# EAGLE design AV_Board (EAGLE 9.6.2)
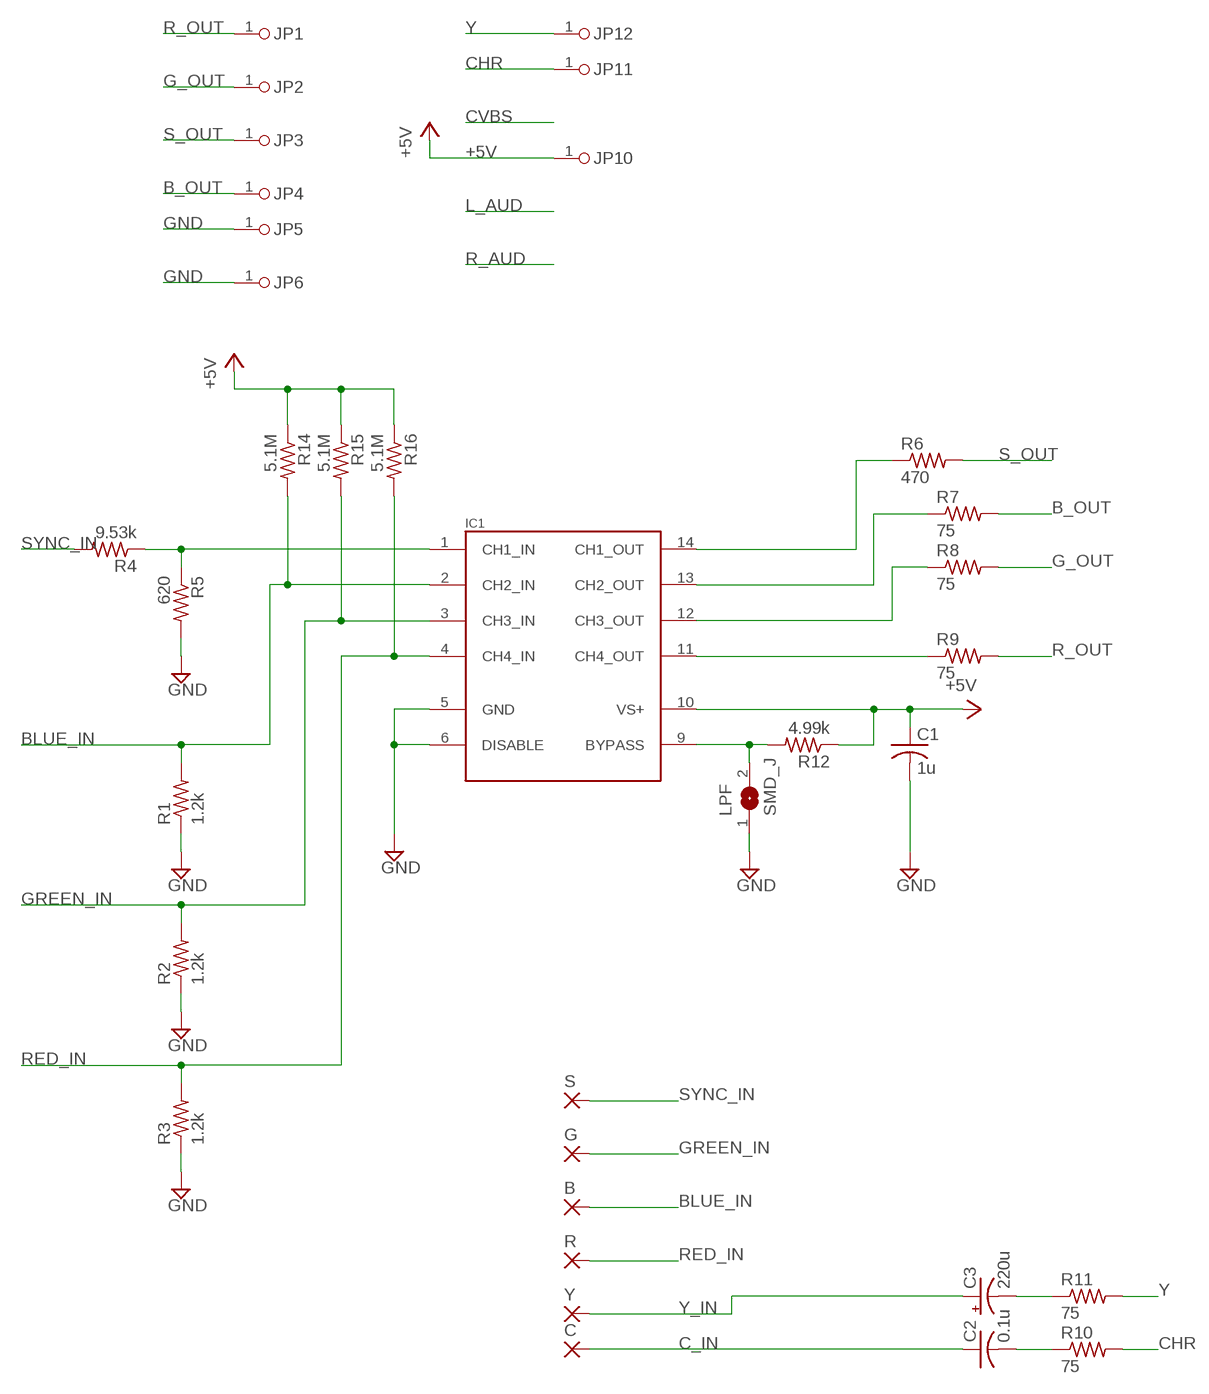
[diagram p0: schematic, sheet 1]

## Parts
B  SMD2  [SMD1,27-2,54]
C  SMD2  [SMD1,27-2,54]
C1  1u  C-USC0603  [C0603]
C2  0.1u  C-USC0603  [C0603]
C3  220u  CPOL-USCT6032  [CT6032]
G  SMD2  [SMD1,27-2,54]
IC1  THS7374IPWR  [TSSOP14]
JP1  PINHD-1X1  [1X01]
JP2  PINHD-1X1  [1X01]
JP3  PINHD-1X1  [1X01]
JP4  PINHD-1X1  [1X01]
JP5  PINHD-1X1  [1X01]
JP6  PINHD-1X1  [1X01]
JP10  PINHD-1X1  [1X01]
JP11  PINHD-1X1  [1X01]
JP12  PINHD-1X1  [1X01]
LPF  SMD_J  [SJ]
R  SMD2  [SMD1,27-2,54]
R1  1.2k  R-US_R0603  [R0603]
R2  1.2k  R-US_R0603  [R0603]
R3  1.2k  R-US_R0603  [R0603]
R4  9.53k  R-US_R0603  [R0603]
R5  620  R-US_R0603  [R0603]
R6  470  R-US_R0603  [R0603]
R7  75  R-US_R0603  [R0603]
R8  75  R-US_R0603  [R0603]
R9  75  R-US_R0603  [R0603]
R10  75  R-US_R0603  [R0603]
R11  75  R-US_R0603  [R0603]
R12  4.99k  R-US_R0603  [R0603]
R14  5.1M  R-US_R0603  [R0603]
R15  5.1M  R-US_R0603  [R0603]
R16  5.1M  R-US_R0603  [R0603]
S  SMD2  [SMD1,27-2,54]
Y  SMD2  [SMD1,27-2,54]

## Nets
+5V: C1.1 IC1.10(VS+) JP10.1 R12.1 R14.1 R15.1 R16.1
B_OUT: JP4.1 R7.2
BLUE_IN: B.1(P) IC1.2(CH2_IN) R1.2 R14.2
C_IN: C2.1 C.1(P)
CHR: JP11.1 R10.2
G_OUT: JP2.1 R8.2
GND: C1.2 IC1.5(GND) IC1.6(DISABLE) JP5.1 JP6.1 LPF.1 R1.1 R2.1 R3.1 R5.2
GREEN_IN: G.1(P) IC1.3(CH3_IN) R2.2 R15.2
N$1: IC1.1(CH1_IN) R4.1 R5.1
N$2: IC1.9(BYPASS) LPF.2 R12.2
N$3: IC1.14(CH1_OUT) R6.1
N$4: IC1.13(CH2_OUT) R7.1
N$5: IC1.12(CH3_OUT) R8.1
N$6: IC1.11(CH4_OUT) R9.1
N$7: C2.2 R10.1
N$10: C3.- R11.1
R_OUT: JP1.1 R9.2
RED_IN: IC1.4(CH4_IN) R3.2 R16.2 R.1(P)
S_OUT: JP3.1 R6.2
SYNC_IN: R4.2 S.1(P)
Y: JP12.1 R11.2
Y_IN: C3.+ Y.1(P)

## Library data of the parts
B C G R S Y = wirepad:SMD2: SMD PAD
C1 C2 = My_Devices:C-US: CAPACITOR, American symbol
C3 = rcl:CPOL-US: POLARIZED CAPACITOR, American symbol; SPICEPREFIX: C
IC1 = My_Devices:THS7374
JP1-JP6 JP10-JP12 = My_Devices:PINHD-1X1: PIN HEADER
LPF = My_Devices:SMD_J
R1-R12 R14-R16 = My_Devices:R-US_: RESISTOR, American symbol

## Board
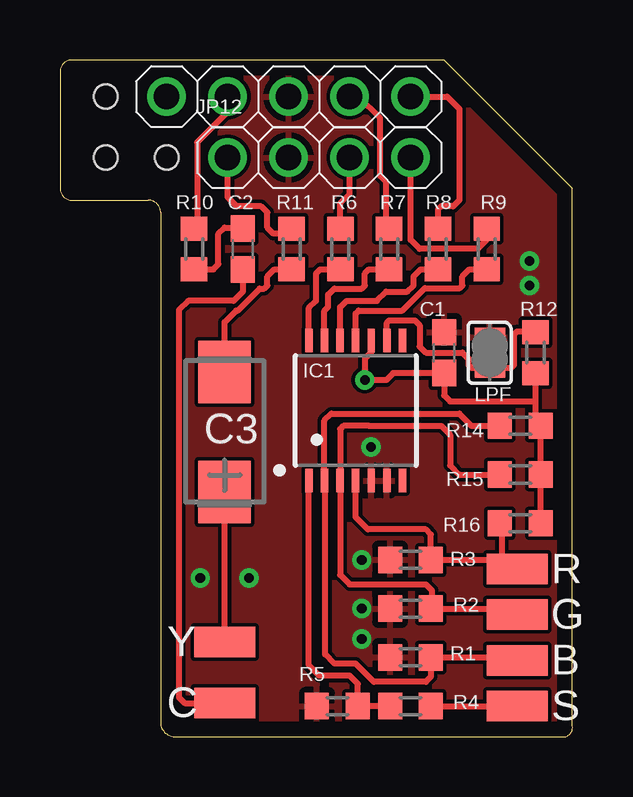
[diagram p1: board, top side]
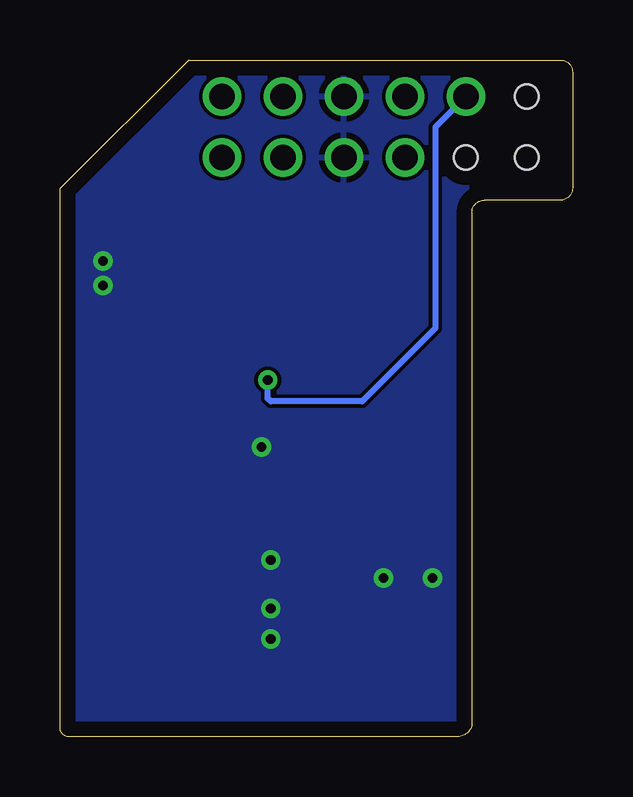
[diagram p2: board, bottom side, seen from below]

Size 21.36 x 28.21 mm. Coordinates in mm from the lower left corner, seen from the top.
Outline: 4.95,0.01 21.08,0.01 arc90 21.34,0.52 21.34,22.87 16,28.21 0.51,28.21 arc90 0,27.7 0,22.87 arc90 0.51,22.36 3.68,22.36 arc-90 4.19,21.86 4.19,0.52 arc90 4.95,0.01
Copper layers (1*16): Top 0.035mm / dielectric 1.5mm / Bottom 0.035mm
Design rules "default *": minimum track width 6mil, minimum drill 0.35mm, track to track 6mil, track to pad 6mil, pad to pad 6mil, via to via 6mil, smd to smd 6mil, copper to edge 25mil, drill to drill 6mil, minimum pad ring 10mil, minimum via ring 8mil, stop-mask expansion 4mil, vias tented up to drill 16mil, thermal gap 10mil
Holes 0.99 mm at 1.91,26.68 1.91,24.14 4.45,24.14

### Footprints (pad centres in the part's own frame; a part is rotated, then mirrored left to right if it is on the bottom)
SMD1,27-2,54 = smd 1.27 x 2.54: 1 0,0
C0603 = smd 1.1 x 1: 1 -0.85,0; 2 0.85,0
CT6032 = smd 2.6 x 2.2: + -2.5,0; - 2.5,0
TSSOP14 = smd 0.305 x 0.991: 1 -1.95,-2.918; 2 -1.3,-2.918; 3 -0.65,-2.918; 4 0,-2.918; 5 0.65,-2.918; 6 1.3,-2.918; 7 1.95,-2.918; 8 1.95,2.918; 9 1.3,2.918; 10 0.65,2.918; 11 0,2.918; 12 -0.65,2.918; 13 -1.3,2.918; 14 -1.95,2.918
1X01 = drill 1.067 pad 1.575: 1 0,0
SJ = smd 0.813 x 1.27: 1 -0.635,0; 2 0.635,0
R0603 = smd 1 x 1.1: 1 -0.85,0; 2 0.85,0

### Placement (x,y rotation side)
B  19.05,3.19 270 top
C  6.86,1.41 270 top
C1  16,16.01 90 top
C2  7.62,20.33 90 top
C3  6.86,12.71 90 top
G  19.05,5.09 270 top
IC1  12.32,13.6 0 top
JP1  14.61,24.14 0 top
JP2  14.61,26.68 0 top
JP3  12.07,24.14 0 top
JP4  12.07,26.68 0 top
JP5  9.53,24.14 0 top
JP6  9.53,26.68 0 top
JP10  4.45,26.68 0 top
JP11  6.99,26.68 0 top
JP12  6.99,24.14 0 top
LPF  17.91,16.01 270 top
R  19.05,7 270 top
R1  14.61,3.31 0 top
R2  14.61,5.35 0 top
R3  14.61,7.38 0 top
R4  14.61,1.28 0 top
R5  11.56,1.28 180 top
R6  11.68,20.33 90 top
R7  13.72,20.33 90 top
R8  15.75,20.33 90 top
R9  17.78,20.33 90 top
R10  5.59,20.33 90 top
R11  9.65,20.33 90 top
R12  19.81,16.01 90 top
R14  19.18,12.97 180 top
R15  19.18,10.93 180 top
R16  19.18,8.9 180 top
S  19.05,1.28 270 top
Y  6.86,3.95 270 top

### Tracks (layer width: path | path; a pad name or v marks a point on that pad's centre or on a via)
+5V  (via drill 0.4)
  Top 0.254: IC1.10 12.97,16.03 12.7,15.76 v12.7,14.87 13.59,14.87 13.88,15.16 C1.1 16,14.24 16.26,13.98 19.81,13.98 | R16.1 R15.1 R14.1 19.81,13.18 19.81,13.98 | R12.1 19.81,13.98
  Bottom 0.254: JP10.1 5.71,25.41 5.71,17.03 8.76,13.98 12.57,13.98 12.7,14.11 v12.7,14.87
B_OUT
  Top 0.254: R7.2 13.59,21.31 13.59,23.13 13.34,23.38 13.34,25.79 12.45,26.68 JP4.1
BLUE_IN
  Top 0.254: B.1 18.92,3.31 R1.2 15.46,2.51 15.24,2.3 13.08,2.3 12.32,3.06 11.43,3.06 11.05,3.44 11.05,10.65 IC1.2 11.02,13.19 11.3,13.47 16.64,13.47 17.14,12.97 R14.2
C_IN
  Top 0.254: C2.1 7.62,18.55 7.24,18.17 5.33,18.17 4.95,17.79 4.95,1.66 5.21,1.41 C.1
CHR
  Top 0.254: JP11.1 6.99,26.05 5.71,24.78 5.71,21.31 R10.2
G_OUT
  Top 0.254: JP2.1 16.13,26.68 16.64,26.17 16.64,22.36 16.38,22.11 15.88,22.11 15.75,21.98 R8.2
GND  (via drill 0.4)
  other vias: 12.57,5.35 12.57,7.38 12.57,4.08 7.87,6.62 5.84,6.62 12.95,12.08 19.56,18.81 19.56,19.82
  pour Bottom: -0.63,29.22 -0.63,-1.26 23.5,-1.26 23.5,29.22
  pour Top: -1.27,-1.26 24.13,-1.26 24.13,29.22 -1.27,29.22
GREEN_IN
  Top 0.254: G.1 18.8,5.35 R2.2 15.49,5.39 15.49,6.11 15.24,6.36 12.07,6.36 11.67,6.76 IC1.3 11.67,12.82 11.81,12.97 12.88,12.97 13.34,12.97 15.88,12.97 16.26,12.59 16.26,11.32 16.64,10.93 R15.2
N$1
  Top 0.254: R4.1 R5.1 12.41,2.21 12.07,2.55 10.79,2.55 10.37,2.98 IC1.1
N$2
  Top 0.254: IC1.9 13.62,17.26 13.72,17.36 14.78,17.36 14.99,17.16 14.99,16.27 15.24,16.01 16.76,16.01 17.02,15.76 17.02,15.51 17.14,15.38 LPF.2 18.8,15.38 18.92,15.51 18.92,16.78 19.05,16.9 19.77,16.9 R12.2
N$3
  Top 0.254: IC1.14 10.37,17.87 10.67,18.17 10.67,19.32 10.83,19.48 R6.1
N$4
  Top 0.254: IC1.13 11.02,17.76 11.18,17.92 11.18,18.43 11.43,18.68 12.57,18.68 12.7,18.81 12.7,19.32 12.87,19.48 R7.1
N$5
  Top 0.254: IC1.12 11.67,17.9 11.94,18.17 13.21,18.17 13.59,18.55 14.48,18.55 14.73,18.81 14.73,19.19 15.03,19.48 R8.1
N$6
  Top 0.254: IC1.11 12.32,17.64 12.45,17.77 14.27,17.77 15.2,18.7 16.66,18.7 16.76,18.81 16.76,19.19 17.06,19.48 R9.1
N$7
  Top 0.254: R10.1 6.39,19.48 6.6,19.7 6.6,20.97 6.86,21.22 7.58,21.22 C2.2
N$10
  Top 0.254: R11.1 8.93,19.48 8.64,19.19 8.64,18.81 8.51,18.68 8.32,18.68 7.41,17.77 7.34,17.77 6.86,17.28 C3.-
R_OUT
  Top 0.254: R9.2 17.78,20.71 17.4,20.33 14.99,20.33 14.61,20.71 JP1.1
RED_IN
  Top 0.254: IC1.4 12.32,9.16 12.83,8.65 15.24,8.65 15.46,8.43 R3.2 18.41,7.38 | 18.41,7.38 18.67,7.38 R.1 | R16.2 18.41,8.81 18.41,7.38
S_OUT
  Top 0.254: R6.2 11.68,22.24 12.07,22.62 JP3.1
SYNC_IN
  Top 0.254: R4.2 S.1
Y
  Top 0.254: R11.2 9.44,20.97 8.89,20.97 8.64,21.22 8.64,21.86 8.38,22.11 7.37,22.11 6.99,22.49 JP12.1
Y_IN
  Top 0.254: Y.1 C3.+